# Altium schematic sheet ArtFire_Status.SchDoc: ArtFire_Status
size OrCAD A; Engineer: LSimon; Revision: V1.0; SheetNumber: 1; SheetTotal: 1
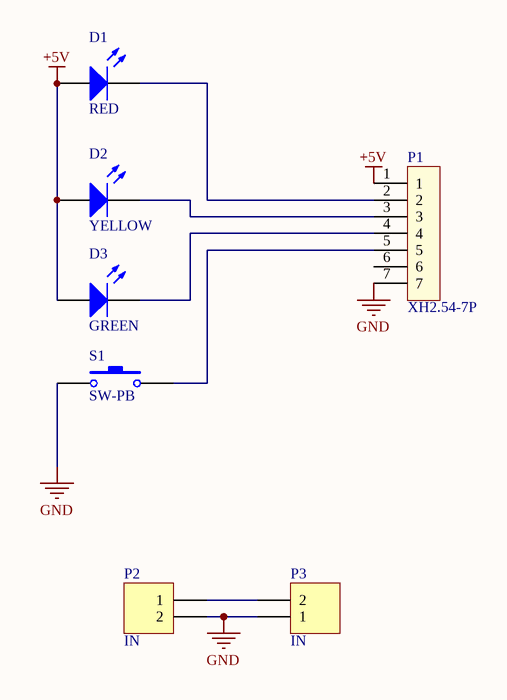
[diagram p0: ArtFire_Status.SchDoc]

## Parts
D1  RED  [LED-1]
D2  YELLOW  [LED-1]
D3  GREEN  [LED-1]
P1  XH2.54-7P  [XH2.54-7P]
P2  IN  [ArtFire_Source_Connector]
P3  IN  [ArtFire_Source_Connector]
S1  SW-PB  [KEY_B]

## Nets
+5V: D1.1(A) D2.1(A) D3.1(A) P1.1
GND: P1.7 P2.2 P3.1 S1.1
NetD1_2: D1.2(K) P1.2
NetD2_2: D2.2(K) P1.3
NetD3_2: D3.2(K) P1.4
NetP1_5: P1.5 S1.2
NetP2_1: P2.1 P3.2

Not connected (* = marked no-connect by the designer): P1 6

## Notes on the sheet
- Title
- Size:
- Date:
- Orcad A
- Number:
- Time:
- Revision:
- Sheet
- of
- File:

## Library data of the parts
D1-D3 = LED1: Typical RED GaAs LED; Published: 8-Jun-2000; LatestRevisionDate: 08-Jul-2005; LatestRevisionNote: Mech Layer 1 removed.; PackageReference: LED-1; Publisher: Altium Limited; PackageDescription: LED; 2 Leads
P2 P3 = Header 2: Header, 2-Pin; LatestRevisionDate: 17-Jul-2002; LatestRevisionNote: Re-released for DXP Platform.; Publisher: Altium Limited
S1 = SW-PB: Switch; Published: 24-Mar-1999; LatestRevisionDate: 17-Jul-2002; LatestRevisionNote: Re-released for DXP Platform.; PackageReference: SPST-2; Publisher: Altium Limited; PackageDescription: Switch; 2 Leads